# Altium schematic sheet ST_LINK.SCHDOC: ST_LINK
size A3; DocumentNumber: MB1144; Revision: C-02; SheetNumber: 25; SheetTotal: 25; Project: STM32L476G-EVAL; ModifiedDate: 9/23/2015
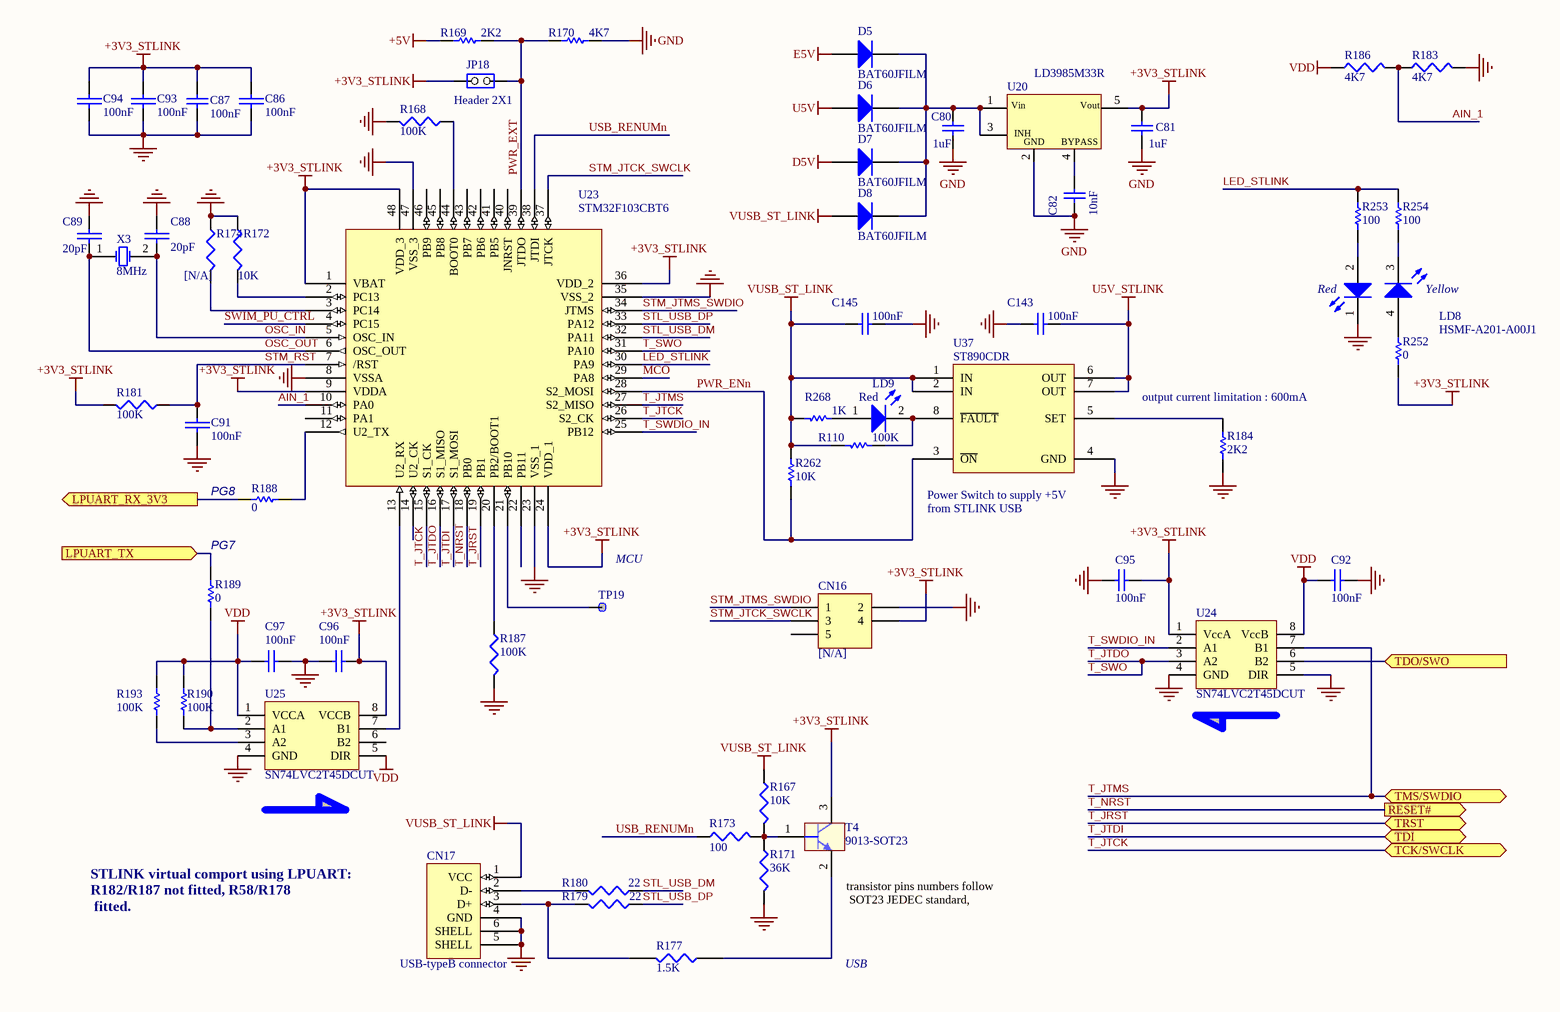
[diagram p0: ST_LINK.SCHDOC]

## Parts
C80  1uF  [0603C]
C81  1uF  [0603C]
C82  10nF  [0402C]
C86  100nF  [0402C]
C87  100nF  [0402C]
C88  20pF  [0402R]
C89  20pF  [0402R]
C91  100nF  [0402C]
C92  100nF  [0402C]
C93  100nF  [0402C]
C94  100nF  [0402C]
C95  100nF  [0402C]
C96  100nF  [0402C]
C97  100nF  [0402C]
C143  100nF  [0402C]
C145  100nF  [0402C]
CN16  [N/A]  [HDR_2X3-1_2R54-6]
CN17  USB-typeB connector  [USB-B]
D5  BAT60JFILM  [SOD-323]
D6  BAT60JFILM  [SOD-323]
D7  BAT60JFILM  [SOD-323]
D8  BAT60JFILM  [SOD-323]
JP18  Header 2X1  [SIP2]
LD8  HSMF-A201-A00J1  [LED2_3528]
LD9  Red  [0603D]
R110  100K  [0402R]
R167  10K  [0402R]
R168  100K  [0402R]
R169  2K2  [0402R]
R170  4K7  [0402R]
R171  36K  [0402R]
R172  10K  [0402R]
R173  100  [0402R]
R174  [N/A]  [0603R]
R177  1.5K  [0402R]
R179  22  [0402R]
R180  22  [0402R]
R181  100K  [0402R]
R183  4K7  [0402R]
R184  2K2  [0402R]
R186  4K7  [0402R]
R187  100K  [0402R]
R188  0  [0603R]
R189  0  [0603R]
R190  100K  [0402R]
R193  100K  [0402R]
R252  0  [0603R]
R253  100  [0402R]
R254  100  [0402R]
R262  10K  [0402R]
R268  1K  [0402R]
T4  9013-SOT23  [SOT-23]
TP19  [N/A]  [TP_C79]  (value not drawn)
U20  LD3985M33R  [SOT23-5]
U23  STM32F103CBT6  [LQFP48_0R5_9X9]
U24  SN74LVC2T45DCUT  [USOP8_0R5_2X3R1]
U25  SN74LVC2T45DCUT  [USOP8_0R5_2X3R1]
U37  ST890CDR  [SOIC8_1R27_4R9X6]
X3  8MHz  [XTAL_2SM_12R7X4R7]

## Ports
LPUART_RX_3V3 (out), LPUART_TX (in), RESET# (out), TCK/SWCLK, TDI, TDO/SWO (in), TMS/SWDIO, TRST

## Nets
+3V3_STLINK: C81.1 C86.2 C87.1 C93.2 C94.2 C95.2 C96.1 CN16.4 JP18.1(COMMON) R181.2 R252.2 T4.3(C) U20.5(Vout) U23.1(VBAT) U23.9(VDDA) U23.24(VDD_1) U23.36(VDD_2) U23.48(VDD_3) U24.1(VccA) U25.8(VCCB)
+5V: R169.2
D5V: D7.1(A)
E5V: D5.1(A)
GND: C80.2 C81.2 C82.2 C86.1 C87.2 C88.1 C89.1 C91.1 C92.2 C93.1 C94.1 C95.1 C96.2 C97.2 C143.1 C145.2 CN16.2 CN17.4(GND) CN17.5(SHELL) CN17.6(SHELL) LD8.1(RED_cathode) R168.2 R170.1 R171.2 R172.1 R174.1 R183.2 R184.2 R187.2 U20.2(GND) U23.8(VSSA) U23.23(VSS_1) U23.35(VSS_2) U23.47(VSS_3) U24.4(GND) U24.5(DIR) U25.4(GND) U37.4(GND)
U5V: D6.1(A)
U5V_STLINK: C143.2 U37.6(OUT) U37.7(OUT)
VDD: C92.1 C97.1 R186.1 R190.1 R193.1 U24.8(VccB) U25.1(VCCA) U25.5(DIR)
VUSB_ST_LINK: C145.1 CN17.1(VCC) D8.1(A) R110.1 R167.1 R262.2 R268.1 U37.1(IN) U37.2(IN)
AIN_1: R183.1 R186.2 U23.10(PA0)
LED_STLINK: R253.1 R254.1 U23.30(PA9)
LPUART_RX_3V3: R188.2 ; port LPUART_RX_3V3
LPUART_TX: R189.1 ; port LPUART_TX
MCO: U23.29(PA8)
OSC_IN: C88.2 U23.5(OSC_IN) X3.2(OSC2)
OSC_OUT: C89.2 U23.6(OSC_OUT) X3.1(OSC1)
PWR_ENn: R262.1 U23.28(S2_MOSI) U37.3(~{ON})
PWR_EXT: JP18.2(NO) R169.1 R170.2 U23.39(JTDO)
STL_USB_DM: R180.1 U23.32(PA11)
STL_USB_DP: R179.1 U23.33(PA12)
STM_JTCK_SWCLK: CN16.3 U23.37(JTCK)
STM_JTMS_SWDIO: CN16.1 U23.34(JTMS)
STM_RST: C91.2 R181.1 U23.7(/RST)
SWIM_PU_CTRL: U23.4(PC15)
T_JRST: U23.19(PB1) ; port TRST
T_JTCK: U23.15(S1_CK) U23.26(S2_CK) ; port TCK/SWCLK
T_JTDI: U23.17(S1_MOSI) ; port TDI
T_JTDO: U23.16(S1_MISO) U23.31(PA10) U24.3(A2)  [also labelled T_SWO]
T_JTMS: U23.27(S2_MISO) U24.7(B1) ; port TMS/SWDIO
T_NRST: U23.18(PB0) ; port RESET#
T_SWDIO_IN: U23.25(PB12) U24.2(A1)
TDO/SWO: U24.6(B2) ; port TDO/SWO
USB_RENUMn: R173.1 U23.38(JTDI)
NetC80_1: C80.1 D5.2(K) D6.2(K) D7.2(K) D8.2(K) U20.1(Vin) U20.3(CE)
NetC82_1: C82.1 U20.4(BYPASS)
NetCN17_2: CN17.2(D-) R180.2
NetCN17_3: CN17.3(D+) R177.2 R179.2
NetLD8_2: LD8.2(Red_anode) R253.2
NetLD8_3: LD8.3(YellowGreen_cathode) R254.2
NetLD8_4: LD8.4(YellowGreen_anode) R252.1
NetLD9_1: LD9.1(A) R268.2
NetLD9_2: LD9.2(K) R110.2 U37.8(~{FAULT})
NetR167_2: R167.2 R171.1 R173.2 T4.1(B)
NetR168_1: R168.1 U23.44(BOOT0)
NetR172_2: R172.2 U23.2(PC13)
NetR174_2: R174.2 U23.3(PC14)
NetR177_1: R177.1 T4.2(E)
NetR184_1: R184.1 U37.5(SET)
NetR187_1: R187.1 U23.20(PB2/BOOT1)
NetR188_1: R188.1 U23.12(U2_TX)
NetR189_2: R189.2 R190.2 U25.2(A1)
NetR193_2: R193.2 U25.3(A2)
NetTP19_1: TP19.1 U23.21(PB10)
NetU23_13: U23.13(U2_RX) U25.7(B1)

Not connected (* = marked no-connect by the designer): CN16 5; U23 11(PA1) 14(U2_CK) 22(PB11) 40(JNRST) 41(PB5) 42(PB6) 43(PB7) 45(PB8) 46(PB9); U25 6(B2)

## Notes on the sheet
- (near R184) output current limitation : 600mA
- (near R188) PG8
- (near U37) Power Switch to supply +5V from STLINK USB
- (near R189) PG7
- (near TP19) MCU
- STLINK virtual comport using LPUART: R182/R187 not fitted, R58/R178
  fitted.
- (near T4) transistor pins numbers follow
  SOT23 JEDEC standard,
- USB
- Title:
- Project:
- Size:
- Date:
- A3
- Reference:
- Sheet:
- Revision:
- of
- (in symbol HSMF-A201-A00J1) Red; Yellow
- (in symbol LD3985M33R) INH

## Library data of the parts
C80 C81 = CAP: Capacitor; Value: 100nF; Ordered by: Subcon; ECCN_US/EU: NA; Published: 8-Jun-2000; Revision: July-2002: Re-released for DXP Platform.; Publisher: Altium Limited
C82 = Cap: Capacitor; Ordered by: Subcon; ECCN_US/EU: NA; Published: 8-Jun-2000; Revision: July-2002: Re-released for DXP Platform.; Publisher: Altium Limited; Value: 10nF
C86 C91 C93 C94 = CAP: Ordered by: Subcon; ECCN_US/EU: NA
C87 = Cap: Capacitor; Value: 10nF; Ordered by: Subcon; ECCN_US/EU: NA; Published: 8-Jun-2000; Revision: July-2002: Re-released for DXP Platform.; Publisher: Altium Limited
C88 C89 = CAP: Capacitor; Ordered by: Subcon; ECCN_US/EU: NA
C92 C95-C97 = CAP: Capacitor; Value: 100pF; Ordered by: Subcon; ECCN_US/EU: NA; Published: 8-Jun-2000; Revision: July-2002: Re-released for DXP Platform.; Publisher: Altium Limited
C143 C145 = Capacitor_ST: Capacitor 0402 / 0603 / 0805; Ordered by: Subcon; ECCN_US/EU: NA; Revision: July-2002: Re-released for DXP Platform.; Value: 100nF
CN16 = Header 3X2: Header, 3-Pin, Dual row; ECCN_US/EU: NA; Ordered by: Subcon; Comments: ST-LINK programming; Fitted: NO; Revision: 17-Jul-2002: Re-released for DXP Platform.; Publisher: Altium Limited
CN17 = USB-typeB connector: ECCN_US/EU: NA; Ordered by: Subcon; Comments: ST-LINK/V2-1 connector
D5-D8 = Diode: Default Diode; Code - JEDEC: DO-214-AB; Ordered by: ST; ECCN_US/EU: EAR99/NEC; Ref St: 9151097; Published: 8-Jun-2000; Revision: July-2002: Re-released for DXP Platform.; Publisher: Altium Limited; Manuf_1: ST; Manuf_Part_1: BAT60JFILM
JP18 = JP2: Ordered by: Subcon; ECCN_US/EU: NA
LD8 = HSMF-A201-A00J1: Ordered by: Subcon; ECCN_US/EU: NA
LD9 = LED2: Typical RED, GREEN, YELLOW, AMBER GaAs LED; Ordered by: Subcon; ECCN_US/EU: NA; Published: 8-Jun-2000; Revision: July-2002: Re-released for DXP Platform.; Publisher: Altium Limited
R110 R188-R190 R193 R252-R254 = Res1: Resistor; Value: 1K; Ordered by: Subcon; ECCN_US/EU: NA; Published: 8-Jun-2000; Revision: July-2002: Re-released for DXP Platform.; Publisher: Altium Limited
R167 R171-R173 = R: Resistor; Right: 20; Bottom: 30; Ordered by: Subcon; ECCN_US/EU: NA
R168 R179-R181 R187 = RES1: Resistor; Ordered by: Subcon; ECCN_US/EU: NA
R169 R170 R184 = res1: Resistor; Value: 1K; Ordered by: Subcon; ECCN_US/EU: NA; Published: 8-Jun-2000; Revision: July-2002: Re-released for DXP Platform.; Publisher: Altium Limited
R174 = R: Right: 20; Bottom: 30; Ordered by: Subcon; ECCN_US/EU: NA; Fitted: NO
R177 R183 R186 = RES1: Ordered by: Subcon; ECCN_US/EU: NA
R262 = Resistor_ST: Resistor; Description: Resistor 0402 or 0603 or 0805; Ordered by: Subcon; ECCN_US/EU: NA; Value: 10K
R268 = Res1: Resistor; Ordered by: Subcon; ECCN_US/EU: NA; Published: 8-Jun-2000; Revision: July-2002: Re-released for DXP Platform.; Publisher: Altium Limited; Value: 1K
T4 = 9013-SOT23: NPN Bipolar Transistor; Manuf_1: Taitron; Manuf_Part_1: MMBT9013; Description: NPN Bipolar Transistor, SOT-23 Footprint; Ordered by: Subcon; ECCN_US/EU: EAR99/NEC; Revision: July-2002: Re-released for DXP Platform.; Order: MMBT9013
TP19 = TP: Ordered by: Subcon; Fitted or not fitted: NO; ECCN_US/EU: NA; Fitted: NO
U20 = LD3985M33R: Ultra low drop-low noise BiCMOS voltage, regulators low ESR capacitors compatible; Manuf_1: ST; Ref St: 9176161; ECCN_US/EU: EAR99/NEC; Manuf_Part_1: LD3985M33R; Provided: ST; Distrib: ST; Order: LD3985M33R; Ordered by: ST
U23 = STM32F10x(48pin): Ordered by: ST; ECCN_US/EU: 3A991A2/NEC; Ref St: 9175111; Manuf_1: ST; Manuf_Part_1: STM32F103CBT6
U24 U25 = SN74LVC2T45DCUT: Manuf_1: TI; Ordered by: Subcon; ECCN_US/EU: EAR99/NEC; Manuf_Part_1: SN74LVC2T45DCUT
U37 = ST890CDR: Ordered by: ST; ECCN_US/EU: EAR99/NEC; Ref St: 9172002; Manuf_1: ST; Manuf_Part_1: ST890CDR
X3 = XTAL: Crystal Oscillator; Manuf_1: jfvny; Manuf_Part_1: SSL8000012AFDHF0-SJ28; Ordered by: Subcon; ECCN_US/EU: NA; Published: 8-Jun-2000; LatestRevisionDate: 17-Jul-2002; LatestRevisionNote: Re-released for DXP Platform.; PackageReference: R38; Publisher: Altium Limited